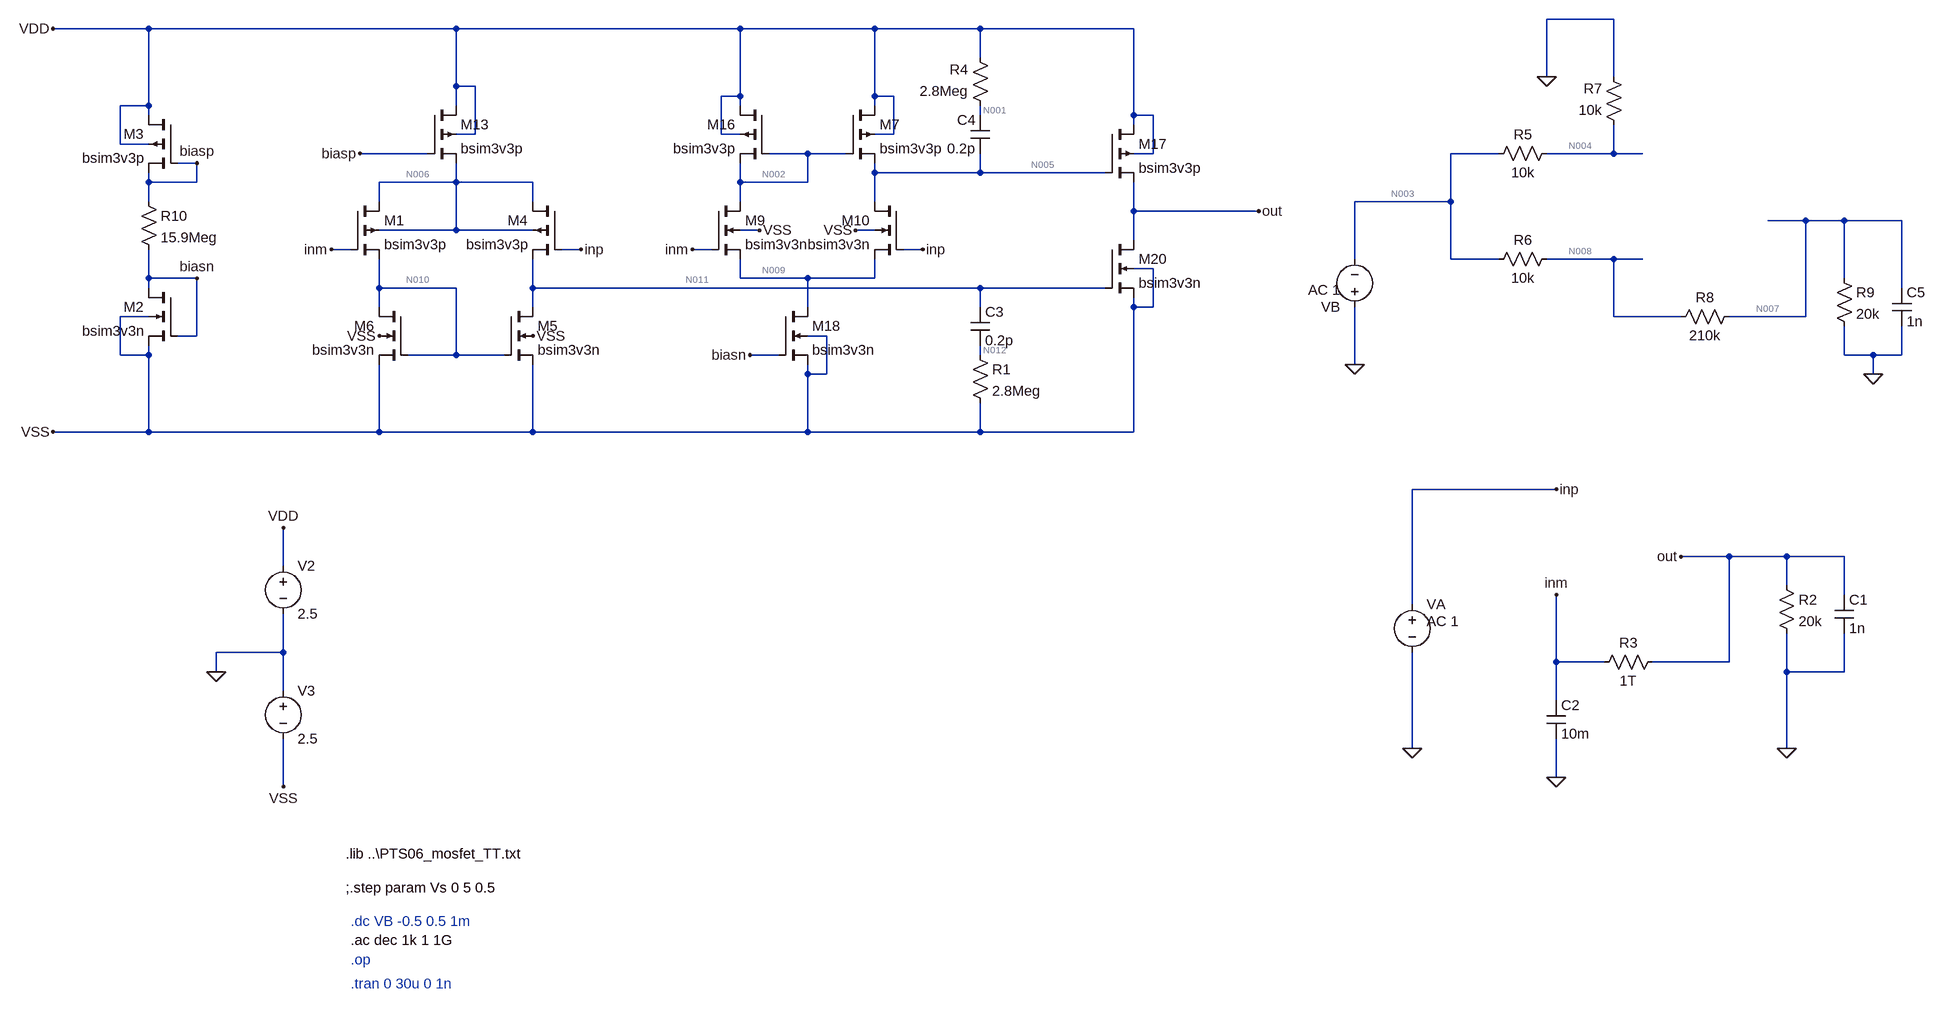
[diagram p0: schematic design_kojima.asc]
design_kojima.asc, the LTspice schematic file:
Version 4
SHEET 1 4152 812
WIRE 3520 -1488 3408 -1488
WIRE 880 -1472 720 -1472
WIRE 1392 -1472 880 -1472
WIRE 2064 -1472 1392 -1472
WIRE 2288 -1472 2064 -1472
WIRE 2464 -1472 2288 -1472
WIRE 2720 -1472 2464 -1472
WIRE 2464 -1424 2464 -1472
WIRE 3408 -1392 3408 -1488
WIRE 3520 -1392 3520 -1488
WIRE 1392 -1376 1392 -1472
WIRE 1424 -1376 1392 -1376
WIRE 2064 -1360 2064 -1472
WIRE 2064 -1360 2032 -1360
WIRE 2288 -1360 2288 -1472
WIRE 2320 -1360 2288 -1360
WIRE 880 -1344 880 -1472
WIRE 880 -1344 832 -1344
WIRE 1392 -1344 1392 -1376
WIRE 2064 -1344 2064 -1360
WIRE 2288 -1344 2288 -1360
WIRE 880 -1328 880 -1344
WIRE 2464 -1328 2464 -1344
WIRE 2720 -1328 2720 -1472
WIRE 2752 -1328 2720 -1328
WIRE 2720 -1312 2720 -1328
WIRE 1424 -1296 1424 -1376
WIRE 1424 -1296 1392 -1296
WIRE 2032 -1296 2032 -1360
WIRE 2064 -1296 2032 -1296
WIRE 2320 -1296 2320 -1360
WIRE 2320 -1296 2288 -1296
WIRE 832 -1280 832 -1344
WIRE 880 -1280 832 -1280
WIRE 1344 -1264 1232 -1264
WIRE 2176 -1264 2112 -1264
WIRE 2240 -1264 2176 -1264
WIRE 2752 -1264 2752 -1328
WIRE 2752 -1264 2720 -1264
WIRE 3328 -1264 3248 -1264
WIRE 3520 -1264 3520 -1312
WIRE 3520 -1264 3408 -1264
WIRE 3568 -1264 3520 -1264
WIRE 960 -1248 928 -1248
WIRE 2288 -1232 2288 -1248
WIRE 2464 -1232 2464 -1264
WIRE 2464 -1232 2288 -1232
WIRE 2672 -1232 2464 -1232
WIRE 880 -1216 880 -1232
WIRE 960 -1216 960 -1248
WIRE 960 -1216 880 -1216
WIRE 1392 -1216 1392 -1248
WIRE 1392 -1216 1264 -1216
WIRE 1520 -1216 1392 -1216
WIRE 2064 -1216 2064 -1248
WIRE 2176 -1216 2176 -1264
WIRE 2176 -1216 2064 -1216
WIRE 880 -1184 880 -1216
WIRE 1264 -1184 1264 -1216
WIRE 1520 -1184 1520 -1216
WIRE 2064 -1184 2064 -1216
WIRE 2288 -1184 2288 -1232
WIRE 3248 -1184 3248 -1264
WIRE 3248 -1184 3088 -1184
WIRE 2720 -1168 2720 -1216
WIRE 2928 -1168 2720 -1168
WIRE 3840 -1152 3776 -1152
WIRE 3904 -1152 3840 -1152
WIRE 4000 -1152 3904 -1152
WIRE 1392 -1136 1392 -1216
WIRE 1392 -1136 1264 -1136
WIRE 1520 -1136 1392 -1136
WIRE 2096 -1136 2064 -1136
WIRE 2288 -1136 2256 -1136
WIRE 2720 -1120 2720 -1168
WIRE 1216 -1104 1184 -1104
WIRE 1600 -1104 1568 -1104
WIRE 2016 -1104 1984 -1104
WIRE 2368 -1104 2336 -1104
WIRE 3088 -1088 3088 -1184
WIRE 3248 -1088 3248 -1184
WIRE 3328 -1088 3248 -1088
WIRE 3520 -1088 3408 -1088
WIRE 3568 -1088 3520 -1088
WIRE 2752 -1072 2720 -1072
WIRE 880 -1056 880 -1104
WIRE 960 -1056 880 -1056
WIRE 2064 -1056 2064 -1088
WIRE 2176 -1056 2064 -1056
WIRE 2288 -1056 2288 -1088
WIRE 2288 -1056 2176 -1056
WIRE 3904 -1056 3904 -1152
WIRE 880 -1040 880 -1056
WIRE 1264 -1040 1264 -1088
WIRE 1392 -1040 1264 -1040
WIRE 1520 -1040 1520 -1088
WIRE 2464 -1040 1520 -1040
WIRE 2672 -1040 2464 -1040
WIRE 4000 -1040 4000 -1152
WIRE 1264 -1008 1264 -1040
WIRE 1520 -1008 1520 -1040
WIRE 2176 -1008 2176 -1056
WIRE 2464 -1008 2464 -1040
WIRE 2720 -1008 2720 -1024
WIRE 2752 -1008 2752 -1072
WIRE 2752 -1008 2720 -1008
WIRE 880 -992 832 -992
WIRE 3520 -992 3520 -1088
WIRE 3632 -992 3520 -992
WIRE 3840 -992 3840 -1152
WIRE 3840 -992 3712 -992
WIRE 960 -960 960 -1056
WIRE 960 -960 928 -960
WIRE 2208 -960 2176 -960
WIRE 832 -928 832 -992
WIRE 880 -928 880 -944
WIRE 880 -928 832 -928
WIRE 1392 -928 1392 -1040
WIRE 1392 -928 1312 -928
WIRE 1472 -928 1392 -928
WIRE 2128 -928 2080 -928
WIRE 2464 -928 2464 -944
WIRE 3904 -928 3904 -976
WIRE 3952 -928 3904 -928
WIRE 4000 -928 4000 -976
WIRE 4000 -928 3952 -928
WIRE 3088 -912 3088 -1008
WIRE 2176 -896 2176 -912
WIRE 2208 -896 2208 -960
WIRE 2208 -896 2176 -896
WIRE 3952 -896 3952 -928
WIRE 880 -800 880 -928
WIRE 880 -800 720 -800
WIRE 1264 -800 1264 -912
WIRE 1264 -800 880 -800
WIRE 1520 -800 1520 -912
WIRE 1520 -800 1264 -800
WIRE 2176 -800 2176 -896
WIRE 2176 -800 1520 -800
WIRE 2464 -800 2464 -848
WIRE 2464 -800 2176 -800
WIRE 2720 -800 2720 -1008
WIRE 2720 -800 2464 -800
WIRE 3424 -704 3184 -704
WIRE 3712 -592 3632 -592
WIRE 3808 -592 3712 -592
WIRE 3904 -592 3808 -592
WIRE 1104 -576 1104 -640
WIRE 3808 -544 3808 -592
WIRE 3904 -528 3904 -592
WIRE 3184 -512 3184 -704
WIRE 1104 -432 1104 -496
WIRE 1104 -432 992 -432
WIRE 3424 -416 3424 -528
WIRE 3504 -416 3424 -416
WIRE 3712 -416 3712 -592
WIRE 3712 -416 3584 -416
WIRE 992 -400 992 -432
WIRE 3808 -400 3808 -464
WIRE 3904 -400 3904 -464
WIRE 3904 -400 3808 -400
WIRE 1104 -368 1104 -432
WIRE 3424 -352 3424 -416
WIRE 3184 -272 3184 -432
WIRE 3808 -272 3808 -400
WIRE 3424 -224 3424 -288
WIRE 1104 -208 1104 -288
FLAG 992 -400 0
FLAG 1104 -208 VSS
FLAG 1104 -640 VDD
FLAG 1264 -960 VSS
FLAG 1520 -960 VSS
FLAG 720 -800 VSS
FLAG 720 -1472 VDD
FLAG 1600 -1104 inp
FLAG 1184 -1104 inm
FLAG 2928 -1168 out
FLAG 960 -1248 biasp
FLAG 1232 -1264 biasp
FLAG 2096 -1136 VSS
FLAG 2256 -1136 VSS
FLAG 960 -1056 biasn
FLAG 2080 -928 biasn
FLAG 1984 -1104 inm
FLAG 2368 -1104 inp
FLAG 3424 -704 inp
FLAG 3424 -528 inm
FLAG 3632 -592 out
FLAG 3184 -272 0
FLAG 3808 -272 0
FLAG 3424 -224 0
FLAG 3408 -1392 0
FLAG 3952 -896 0
FLAG 3088 -912 0
DATAFLAG 1376 -1040 ""
DATAFLAG 1360 -1216 ""
DATAFLAG 1664 -1040 ""
DATAFLAG 2624 -1232 ""
DATAFLAG 2816 -1168 ""
DATAFLAG 1712 -800 ""
DATAFLAG 1680 -1472 ""
DATAFLAG 2176 -1056 ""
DATAFLAG 2144 -1264 ""
DATAFLAG 960 -1216 ""
DATAFLAG 960 -960 ""
SYMBOL voltage 1104 -592 R0
WINDOW 123 0 0 Left 0
WINDOW 39 0 0 Left 0
SYMATTR InstName V2
SYMATTR Value 2.5
SYMBOL voltage 1104 -384 R0
WINDOW 123 0 0 Left 0
WINDOW 39 0 0 Left 0
SYMATTR InstName V3
SYMATTR Value 2.5
SYMBOL nmos4 2016 -1184 R0
SYMATTR InstName M9
SYMATTR Value bsim3v3n
SYMATTR Value2 l=0.6u w=1.2u m=8
SYMBOL nmos4 2336 -1184 M0
SYMATTR InstName M10
SYMATTR Value bsim3v3n
SYMATTR Value2 l=0.6u w=1.2u m=8
SYMBOL nmos4 2128 -1008 R0
SYMATTR InstName M18
SYMATTR Value bsim3v3n
SYMATTR Value2 l=1.8u w=2.4u m=8
SYMBOL pmos4 1216 -1184 R0
SYMATTR InstName M1
SYMATTR Value bsim3v3p
SYMATTR Value2 l=0.6u w=1.2u m=8
SYMBOL pmos4 1568 -1184 M0
SYMATTR InstName M4
SYMATTR Value bsim3v3p
SYMATTR Value2 l=0.6u w=1.2u m=8
SYMBOL pmos4 1344 -1344 R0
SYMATTR InstName M13
SYMATTR Value bsim3v3p
SYMATTR Value2 l=1.8u w=1.2u m=8
SYMBOL res 3600 -432 R90
WINDOW 0 0 56 VBottom 2
WINDOW 3 32 56 VTop 2
SYMATTR InstName R3
SYMATTR Value 1T
SYMBOL res 3792 -560 R0
SYMATTR InstName R2
SYMATTR Value 20k
SYMBOL cap 3888 -528 R0
SYMATTR InstName C1
SYMATTR Value 1n
SYMBOL voltage 3184 -528 R0
WINDOW 123 24 44 Left 2
WINDOW 39 0 0 Left 0
SYMATTR Value2 AC 1
SYMATTR InstName VA
SYMATTR Value ""
SYMBOL cap 3408 -352 R0
SYMATTR InstName C2
SYMATTR Value 10m
SYMBOL nmos4 1472 -1008 R0
SYMATTR InstName M5
SYMATTR Value bsim3v3n
SYMATTR Value2 l=1.9u w=1.2u m=8
SYMBOL nmos4 1312 -1008 M0
SYMATTR InstName M6
SYMATTR Value bsim3v3n
SYMATTR Value2 l=1.9u w=1.2u m=8
SYMBOL pmos4 2240 -1344 R0
SYMATTR InstName M7
SYMATTR Value bsim3v3p
SYMATTR Value2 l=4.4u w=1.2u m=8
SYMBOL pmos4 2112 -1344 M0
SYMATTR InstName M16
SYMATTR Value bsim3v3p
SYMATTR Value2 l=4.4u w=1.2u m=8
SYMBOL res 3424 -1280 R90
WINDOW 0 0 56 VBottom 2
WINDOW 3 32 56 VTop 2
SYMATTR InstName R5
SYMATTR Value 10k
SYMBOL res 3424 -1104 R90
WINDOW 0 0 56 VBottom 2
WINDOW 3 32 56 VTop 2
SYMATTR InstName R6
SYMATTR Value 10k
SYMBOL res 3536 -1296 R180
WINDOW 0 36 76 Left 2
WINDOW 3 36 40 Left 2
SYMATTR InstName R7
SYMATTR Value 10k
SYMBOL res 3616 -976 R270
WINDOW 0 32 56 VTop 2
WINDOW 3 0 56 VBottom 2
SYMATTR InstName R8
SYMATTR Value 210k
SYMBOL res 3888 -1072 R0
SYMATTR InstName R9
SYMATTR Value 20k
SYMBOL cap 3984 -1040 R0
SYMATTR InstName C5
SYMATTR Value 1n
SYMBOL voltage 3088 -992 R180
WINDOW 123 24 44 Left 2
WINDOW 39 0 0 Left 0
WINDOW 3 24 72 Invisible 2
SYMATTR Value2 AC 1
SYMATTR Value PWL(0 -0.1 100n -0.1 100.5n 0.1 20u 0.1 20000.05n -0.1)
SYMATTR InstName VB
SYMBOL pmos4 2672 -1312 R0
SYMATTR InstName M17
SYMATTR Value bsim3v3p
SYMATTR Value2 l=0.6u w=1.2u m=20
SYMBOL nmos4 2672 -1120 R0
SYMATTR InstName M20
SYMATTR Value bsim3v3n
SYMATTR Value2 l=0.6u w=4u m=4
SYMBOL cap 2448 -1008 R0
SYMATTR InstName C3
SYMATTR Value 0.2p
SYMBOL res 2448 -944 R0
SYMATTR InstName R1
SYMATTR Value 2.8Meg
SYMBOL cap 2480 -1264 R180
WINDOW 0 24 56 Left 2
WINDOW 3 24 8 Left 2
SYMATTR InstName C4
SYMATTR Value 0.2p
SYMBOL res 2480 -1328 R180
WINDOW 0 36 76 Left 2
WINDOW 3 36 40 Left 2
SYMATTR InstName R4
SYMATTR Value 2.8Meg
SYMBOL nmos4 928 -1040 M0
SYMATTR InstName M2
SYMATTR Value bsim3v3n
SYMATTR Value2 l=18u w=2.4u m=8
SYMBOL pmos4 928 -1328 M0
SYMATTR InstName M3
SYMATTR Value bsim3v3p
SYMATTR Value2 l=18u w=1.2u m=8
SYMBOL res 864 -1200 R0
SYMATTR InstName R10
SYMATTR Value 15.9Meg
TEXT 1208 -96 Left 2 !.lib ..\\PTS06_mosfet_TT.txt
TEXT 1208 -40 Left 2 !;.step param Vs 0 5 0.5
TEXT 1216 16 Left 2 ;.dc VB -0.5 0.5 1m
TEXT 1216 48 Left 2 !.ac dec 1k 1 1G
TEXT 1216 80 Left 2 ;.op
TEXT 1216 120 Left 2 ;.tran 0 30u 0 1n

The netlist it stands for:
* design_kojima.asc
V2 VDD 0 2.5
V3 0 VSS 2.5
M9 N002 inm N009 VSS bsim3v3n l=0.6u w=1.2u m=8
M10 N005 inp N009 VSS bsim3v3n l=0.6u w=1.2u m=8
M18 N009 biasn VSS VSS bsim3v3n l=1.8u w=2.4u m=8
M1 N006 inm N010 N006 bsim3v3p l=0.6u w=1.2u m=8
M4 N006 inp N011 N006 bsim3v3p l=0.6u w=1.2u m=8
M13 VDD biasp N006 VDD bsim3v3p l=1.8u w=1.2u m=8
R3 out inm 1T
R2 out 0 20k
C1 out 0 1n
VA inp 0 AC 1
C2 inm 0 10m
M5 N011 N010 VSS VSS bsim3v3n l=1.9u w=1.2u m=8
M6 N010 N010 VSS VSS bsim3v3n l=1.9u w=1.2u m=8
M7 VDD N002 N005 VDD bsim3v3p l=4.4u w=1.2u m=8
M16 VDD N002 N002 VDD bsim3v3p l=4.4u w=1.2u m=8
R5 N004 N003 10k
R6 N008 N003 10k
R7 N004 0 10k
R8 N008 N007 210k
R9 N007 0 20k
C5 N007 0 1n
VB 0 N003 PWL(0 -0.1 100n -0.1 100.5n 0.1 20u 0.1 20000.05n -0.1) AC 1
M17 VDD N005 out VDD bsim3v3p l=0.6u w=1.2u m=20
M20 out N011 VSS VSS bsim3v3n l=0.6u w=4u m=4
C3 N011 N012 0.2p
R1 N012 VSS 2.8Meg
C4 N005 N001 0.2p
R4 N001 VDD 2.8Meg
M2 biasn biasn VSS VSS bsim3v3n l=18u w=2.4u m=8
M3 VDD biasp biasp VDD bsim3v3p l=18u w=1.2u m=8
R10 biasp biasn 15.9Meg
.model NMOS NMOS
.model PMOS PMOS
.lib standard.mos
.lib ..\PTS06_mosfet_TT.txt
;.step param Vs 0 5 0.5
* .dc VB -0.5 0.5 1m
.ac dec 1k 1 1G
* .op
* .tran 0 30u 0 1n
.backanno
.end

* Results of the author's LTspice run, read from the files saved beside the schematic
* Operating Point, zero values left out:
*   V(vdd) = 2.5 V
*   V(vss) = -2.5 V
*   V(n002) = 1.381 V
*   V(inm) = 470.4 µV
*   V(n009) = -1.165 V
*   V(n005) = 1.427 V
*   V(biasn) = -1.832 V
*   V(n006) = 937.8 mV
*   V(n010) = -1.794 V
*   V(n011) = -1.739 V
*   V(biasp) = 1.349 V
*   V(out) = 475.1 µV
*   V(n004) = 50 mV
*   V(n003) = 100 mV
*   V(n008) = 95.83 mV
*   V(n007) = 8.333 mV
*   V(n012) = -2.5 V
*   V(n001) = 2.5 V
*   Id(M9) = 703.2 nA
*   Ib(M9) = -46.24 pA
*   Is(M9) = -703.1 nA
*   Id(M10) = 702.9 nA
*   Ib(M10) = -48.16 pA
*   Is(M10) = -702.8 nA
*   Id(M18) = 1.406 µA
*   Ib(M18) = -10.76 pA
*   Is(M18) = -1.406 µA
*   Id(M5) = 1.17 µA
*   Ib(M5) = -6.17 pA
*   Is(M5) = -1.17 µA
*   Id(M6) = 1.169 µA
*   Ib(M6) = -5.724 pA
*   Is(M6) = -1.169 µA
*   Id(M20) = 13.14 µA
*   Ib(M20) = -530.6 pA
*   Is(M20) = -13.14 µA
*   Id(M2) = 200 nA
*   Ib(M2) = -5.424 pA
*   Is(M2) = -200 nA
*   Id(M1) = 1.169 µA
*   Ib(M1) = 22.46 pA
*   Is(M1) = -1.169 µA
*   Id(M4) = 1.17 µA
*   Ib(M4) = 21.86 pA
*   Is(M4) = -1.17 µA
*   Id(M13) = 2.339 µA
*   Ib(M13) = 12.58 pA
*   Is(M13) = -2.339 µA
*   Id(M7) = 702.8 nA
*   Ib(M7) = 8.666 pA
*   Is(M7) = -702.9 nA
*   Id(M16) = 703.2 nA
*   Ib(M16) = 9.031 pA
*   Is(M16) = -703.2 nA
*   Id(M17) = 13.17 µA
*   Ib(M17) = 50.79 pA
*   Is(M17) = -13.17 µA
*   Id(M3) = 200 nA
*   Ib(M3) = 9.292 pA
*   Is(M3) = -200 nA
*   I(R2) = 23.75 nA
*   I(R5) = -5 µA
*   I(R6) = -416.7 nA
*   I(R7) = 5 µA
*   I(R8) = 416.7 nA
*   I(R9) = 416.7 nA
*   I(R10) = 200 nA
*   I(V2) = -17.11 µA
*   I(V3) = -17.09 µA
*   I(Vb) = 5.417 µA